# Altium schematic sheet KS-WL-GW-IO.SchDoc
size A3; CheckedBy: Fanmingjie; Author: Jason Huang; DrawnBy: Chen Minjie; Address1: Buliding 5, No.1528,; Address2: Gu Mei Rd HQ6,; Address3: Shanghai, China; Address4: 200233; Revision: 0.1; SheetNumber: 1; SheetTotal: 1; DocumentName: NGHA SCC V0.1; ProjectName: NGHA
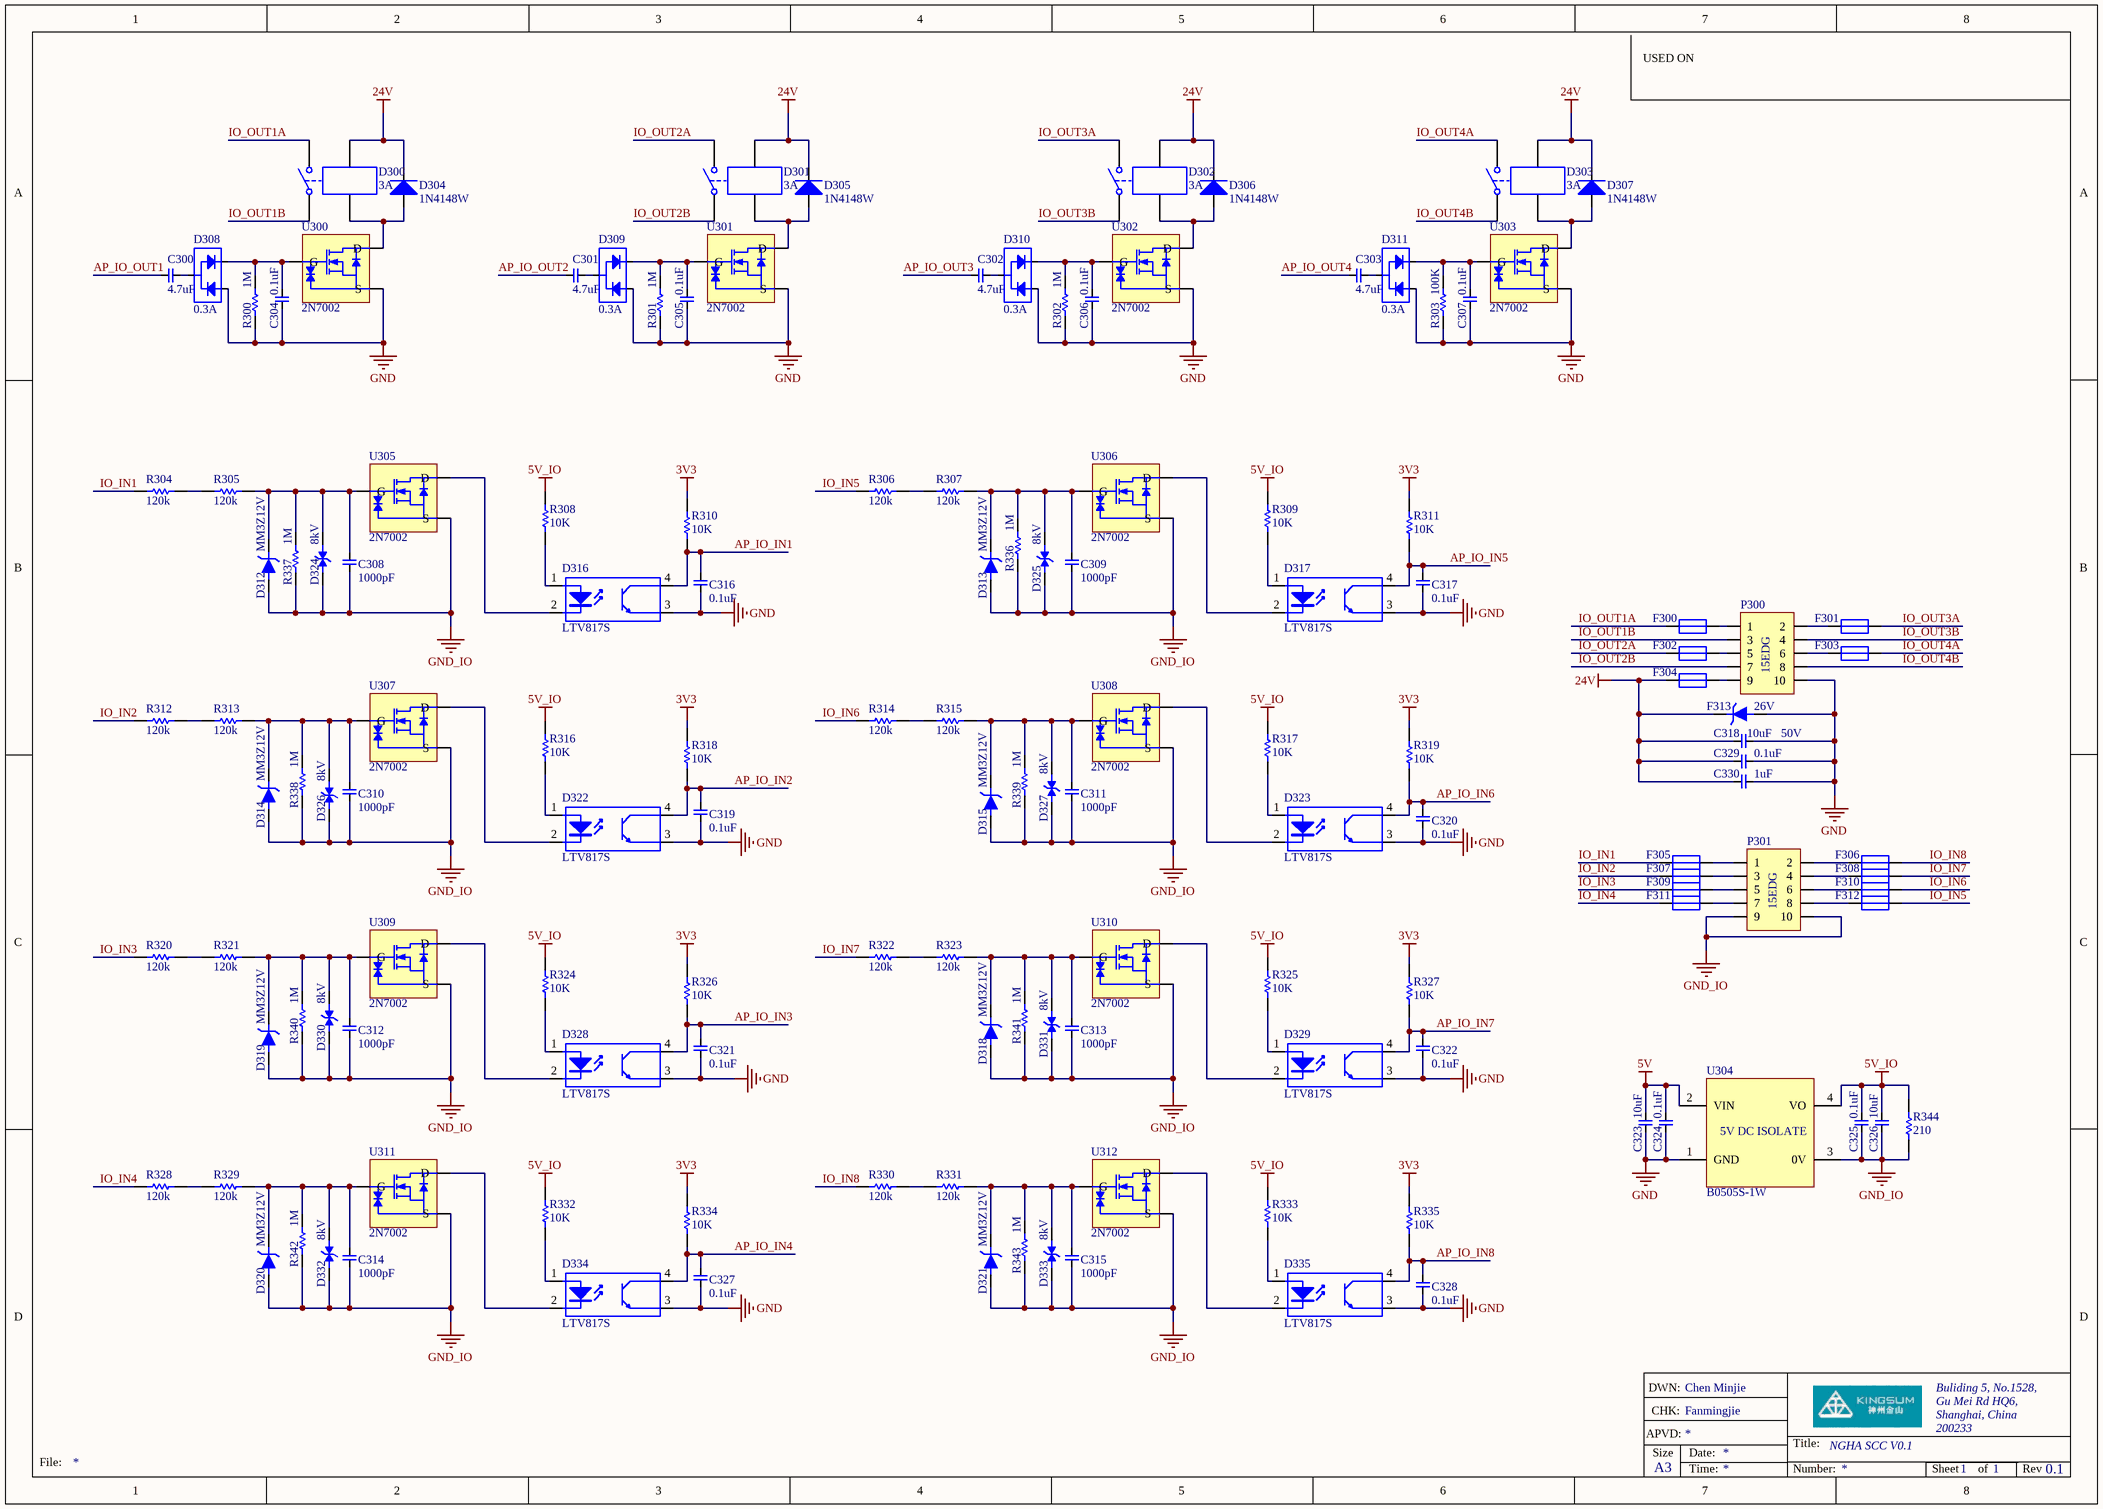
[diagram p0: KS-WL-GW-IO.SchDoc]

## Parts
C300  4.7uF  [C0805]
C301  4.7uF  [C0805]
C302  4.7uF  [C0805]
C303  4.7uF  [C0805]
C304  0.1uF  [0402 CAP]
C305  0.1uF  [0402 CAP]
C306  0.1uF  [0402 CAP]
C307  0.1uF  [0402 CAP]
C308  1000pF  [0402 CAP]
C309  1000pF  [0402 CAP]
C310  1000pF  [0402 CAP]
C311  1000pF  [0402 CAP]
C312  1000pF  [0402 CAP]
C313  1000pF  [0402 CAP]
C314  1000pF  [0402 CAP]
C315  1000pF  [0402 CAP]
C316  0.1uF  [0402 CAP]
C317  0.1uF  [0402 CAP]
C318  10uF  Volt-Rated: 50V  [C1206_L]
C319  0.1uF  [0402 CAP]
C320  0.1uF  [0402 CAP]
C321  0.1uF  [0402 CAP]
C322  0.1uF  [0402 CAP]
C323  10uF  [C1206_L]
C324  0.1uF  [0402 CAP]
C325  0.1uF  [0402 CAP]
C326  10uF  [C1206_L]
C327  0.1uF  [0402 CAP]
C328  0.1uF  [0402 CAP]
C329  0.1uF  [0402 CAP]
C330  1uF  [C0805]
D300  3A  [OJ]
D301  3A  [OJ]
D302  3A  [OJ]
D303  3A  [OJ]
D304  1N4148W  [SOD123]
D305  1N4148W  [SOD123]
D306  1N4148W  [SOD123]
D307  1N4148W  [SOD123]
D308  0.3A  [SOT-23-3]
D309  0.3A  [SOT-23-3]
D310  0.3A  [SOT-23-3]
D311  0.3A  [SOT-23-3]
D312  MM3Z12V  [LC-SOD-323]
D313  MM3Z12V  [LC-SOD-323]
D314  MM3Z12V  [LC-SOD-323]
D315  MM3Z12V  [LC-SOD-323]
D316  LTV817S  [TLV817S]
D317  LTV817S  [TLV817S]
D318  MM3Z12V  [LC-SOD-323]
D319  MM3Z12V  [LC-SOD-323]
D320  MM3Z12V  [LC-SOD-323]
D321  MM3Z12V  [LC-SOD-323]
D322  LTV817S  [TLV817S]
D323  LTV817S  [TLV817S]
D324  8kV  [0402 ESD]
D325  8kV  [0402 ESD]
D326  8kV  [0402 ESD]
D327  8kV  [0402 ESD]
D328  LTV817S  [TLV817S]
D329  LTV817S  [TLV817S]
D330  8kV  [0402 ESD]
D331  8kV  [0402 ESD]
D332  8kV  [0402 ESD]
D333  8kV  [0402 ESD]
D334  LTV817S  [TLV817S]
D335  LTV817S  [TLV817S]
F300  1206L025YR  [1206_FUSE]  (value not drawn)
F301  1206L025YR  [1206_FUSE]  (value not drawn)
F302  1206L025YR  [1206_FUSE]  (value not drawn)
F303  1206L025YR  [1206_FUSE]  (value not drawn)
F304  1206L025YR  [1206_FUSE]  (value not drawn)
F305  1206L025YR  [1206_FUSE]  (value not drawn)
F306  1206L025YR  [1206_FUSE]  (value not drawn)
F307  1206L025YR  [1206_FUSE]  (value not drawn)
F308  1206L025YR  [1206_FUSE]  (value not drawn)
F309  1206L025YR  [1206_FUSE]  (value not drawn)
F310  1206L025YR  [1206_FUSE]  (value not drawn)
F311  1206L025YR  [1206_FUSE]  (value not drawn)
F312  1206L025YR  [1206_FUSE]  (value not drawn)
F313  26V  [LC-SMB(DO-214AA)_S5]
P300  Kingsum-CONN-15EDG 5X2  [15EDG-5x2 LOCK]  (value not drawn)
P301  Kingsum-CONN-15EDG 5X2  [15EDG-5x2 LOCK]  (value not drawn)
R300  1M  [0402 Res]
R301  1M  [0402 Res]
R302  1M  [0402 Res]
R303  100K  [0402 Res]
R304  120k  [1206 RES]
R305  120k  [1206 RES]
R306  120k  [1206 RES]
R307  120k  [1206 RES]
R308  10K  [0402 Res]
R309  10K  [0402 Res]
R310  10K  [0402 Res]
R311  10K  [0402 Res]
R312  120k  [1206 RES]
R313  120k  [1206 RES]
R314  120k  [1206 RES]
R315  120k  [1206 RES]
R316  10K  [0402 Res]
R317  10K  [0402 Res]
R318  10K  [0402 Res]
R319  10K  [0402 Res]
R320  120k  [1206 RES]
R321  120k  [1206 RES]
R322  120k  [1206 RES]
R323  120k  [1206 RES]
R324  10K  [0402 Res]
R325  10K  [0402 Res]
R326  10K  [0402 Res]
R327  10K  [0402 Res]
R328  120k  [1206 RES]
R329  120k  [1206 RES]
R330  120k  [1206 RES]
R331  120k  [1206 RES]
R332  10K  [0402 Res]
R333  10K  [0402 Res]
R334  10K  [0402 Res]
R335  10K  [0402 Res]
R336  1M  [0402 Res]
R337  1M  [0402 Res]
R338  1M  [0402 Res]
R339  1M  [0402 Res]
R340  1M  [0402 Res]
R341  1M  [0402 Res]
R342  1M  [0402 Res]
R343  1M  [0402 Res]
R344  210  [0805 Res]
U300  2N7002  [SOT-23-3]
U301  2N7002  [SOT-23-3]
U302  2N7002  [SOT-23-3]
U303  2N7002  [SOT-23-3]
U304  B0505S-1W  [B0505S]
U305  2N7002  [SOT-23-3]
U306  2N7002  [SOT-23-3]
U307  2N7002  [SOT-23-3]
U308  2N7002  [SOT-23-3]
U309  2N7002  [SOT-23-3]
U310  2N7002  [SOT-23-3]
U311  2N7002  [SOT-23-3]
U312  2N7002  [SOT-23-3]

## Nets
3V3: R310.2 R311.2 R318.2 R319.2 R326.2 R327.2 R334.2 R335.2
5V: C323.2 C324.2 U304.2(VIN)
5V_IO: C325.2 C326.2 R308.2 R309.2 R316.2 R317.2 R324.2 R325.2 R332.2 R333.2 R344.2 U304.4(VO)
24V: C318.1 C329.2 C330.2 D300.4 D301.4 D302.4 D303.4 D304.2 D305.2 D306.2 D307.2 F304.1 F313.2
GND: C304.1 C305.1 C306.1 C307.1 C316.1 C317.1 C318.2 C319.1 C320.1 C321.1 C322.1 C323.1 C324.1 C327.1 C328.1 C329.1 C330.1 D308.1 D309.1 D310.1 D311.1 D316.3(A/K) D317.3(A/K) D322.3(A/K) D323.3(A/K) D328.3(A/K) D329.3(A/K) D334.3(A/K) D335.3(A/K) F313.1 P300.10 R300.2 R301.2 R302.2 R303.1 U300.2(S) U301.2(S) U302.2(S) U303.2(S) U304.1(GND)
GND_IO: C308.1 C309.1 C310.1 C311.1 C312.1 C313.1 C314.1 C315.1 C325.1 C326.1 D312.1 D313.1 D314.1 D315.1 D318.1 D319.1 D320.1 D321.1 D324.1 D325.1 D326.1 D327.1 D330.1 D331.1 D332.1 D333.1 P301.9 P301.10 R336.1 R337.1 R338.1 R339.1 R340.1 R341.1 R342.1 R343.1 R344.1 U304.3(0V) U305.2(S) U306.2(S) U307.2(S) U308.2(S) U309.2(S) U310.2(S) U311.2(S) U312.2(S)
AP_IO_IN1: C316.2 D316.4(A/K) R310.1
AP_IO_IN2: C319.2 D322.4(A/K) R318.1
AP_IO_IN3: C321.2 D328.4(A/K) R326.1
AP_IO_IN4: C327.2 D334.4(A/K) R334.1
AP_IO_IN5: C317.2 D317.4(A/K) R311.1
AP_IO_IN6: C320.2 D323.4(A/K) R319.1
AP_IO_IN7: C322.2 D329.4(A/K) R327.1
AP_IO_IN8: C328.2 D335.4(A/K) R335.1
AP_IO_OUT1: C300.2
AP_IO_OUT2: C301.2
AP_IO_OUT3: C302.2
AP_IO_OUT4: C303.2
IO_IN1: F305.1 R304.1
IO_IN2: F307.1 R312.1
IO_IN3: F309.1 R320.1
IO_IN4: F311.1 R328.1
IO_IN5: F312.2 R306.1
IO_IN6: F310.2 R314.1
IO_IN7: F308.2 R322.1
IO_IN8: F306.2 R330.1
IO_OUT1A: D300.2 F300.1
IO_OUT1B: D300.1 P300.3
IO_OUT2A: D301.2 F302.1
IO_OUT2B: D301.1 P300.7
IO_OUT3A: D302.2 F301.2
IO_OUT3B: D302.1 P300.4
IO_OUT4A: D303.2 F303.2
IO_OUT4B: D303.1 P300.8
NetC300_1: C300.1 D308.3
NetC301_1: C301.1 D309.3
NetC302_1: C302.1 D310.3
NetC303_1: C303.1 D311.3
NetC304_2: C304.2 D308.2 R300.1 U300.1(G)
NetC305_2: C305.2 D309.2 R301.1 U301.1(G)
NetC306_2: C306.2 D310.2 R302.1 U302.1(G)
NetC307_2: C307.2 D311.2 R303.2 U303.1(G)
NetC308_2: C308.2 D312.2 D324.2 R305.2 R337.2 U305.1(G)
NetC309_2: C309.2 D313.2 D325.2 R307.2 R336.2 U306.1(G)
NetC310_2: C310.2 D314.2 D326.2 R313.2 R338.2 U307.1(G)
NetC311_2: C311.2 D315.2 D327.2 R315.2 R339.2 U308.1(G)
NetC312_2: C312.2 D319.2 D330.2 R321.2 R340.2 U309.1(G)
NetC313_2: C313.2 D318.2 D331.2 R323.2 R341.2 U310.1(G)
NetC314_2: C314.2 D320.2 D332.2 R329.2 R342.2 U311.1(G)
NetC315_2: C315.2 D321.2 D333.2 R331.2 R343.2 U312.1(G)
NetD300_3: D300.3 D304.1 U300.3(D)
NetD301_3: D301.3 D305.1 U301.3(D)
NetD302_3: D302.3 D306.1 U302.3(D)
NetD303_3: D303.3 D307.1 U303.3(D)
NetD316_1: D316.1(A) R308.1
NetD316_2: D316.2(K) U305.3(D)
NetD317_1: D317.1(A) R309.1
NetD317_2: D317.2(K) U306.3(D)
NetD322_1: D322.1(A) R316.1
NetD322_2: D322.2(K) U307.3(D)
NetD323_1: D323.1(A) R317.1
NetD323_2: D323.2(K) U308.3(D)
NetD328_1: D328.1(A) R324.1
NetD328_2: D328.2(K) U309.3(D)
NetD329_1: D329.1(A) R325.1
NetD329_2: D329.2(K) U310.3(D)
NetD334_1: D334.1(A) R332.1
NetD334_2: D334.2(K) U311.3(D)
NetD335_1: D335.1(A) R333.1
NetD335_2: D335.2(K) U312.3(D)
NetF300_2: F300.2 P300.1
NetF301_1: F301.1 P300.2
NetF302_2: F302.2 P300.5
NetF303_1: F303.1 P300.6
NetF304_2: F304.2 P300.9
NetF305_2: F305.2 P301.1
NetF306_1: F306.1 P301.2
NetF307_2: F307.2 P301.3
NetF308_1: F308.1 P301.4
NetF309_2: F309.2 P301.5
NetF310_1: F310.1 P301.6
NetF311_2: F311.2 P301.7
NetF312_1: F312.1 P301.8
NetR304_2: R304.2 R305.1
NetR306_2: R306.2 R307.1
NetR312_2: R312.2 R313.1
NetR314_2: R314.2 R315.1
NetR320_2: R320.2 R321.1
NetR322_2: R322.2 R323.1
NetR328_2: R328.2 R329.1
NetR330_2: R330.2 R331.1

## Notes on the sheet
- USED ON
- DWN:
- APVD:
- CHK:
- Size
- Date:
- Title:
- File:
- A3
- Time:
- Number:
- Sheet
- of
- Rev
- (in symbol Kingsum-CONN-15EDG 5X2) 15EDG
- (in symbol Kingsum-DCDC-B0505S-1W) 5V DC ISOLATE

## Library data of the parts
C300-C303 = ADE-C0805-4.7U: Non-polarised capacitor; Part Rev: V; Part Description: CAPACITOR, CERAMIC CHIP, 0805 CASE, SURFACE MOUNT , 2.2 uF +/-10% 25 V, X5R; Mfr_PN: GRM219R61E475KA73; Manufacturer: MURATA; Tolerance: +/-10%; Volt-Rated: 25 V; Signal Integrity: Cap; Option: 0; TE PN: ADE-C0805-4.7U; Series: MLCC; RoHS Compliant: YES; Value: 4.7uF; Package: C0805; SPICE model: CAP; Published: 10/17/2016; Publisher: TE Connectivity; LatestRevisionDate: 04/22/2013; LatestRevisionNote: Production; ComponentLink1Description: Datasheet; ComponentLink1URL: http://engineeringportal.tycoelectronics.com/web/engineering/part-inquiry?PartNo=1-20065-7; ComponentLink3Description: Package; ComponentLink3URL: http://www.murata.com/products/catalog/pdf/c02e.pdf; ComponentLink2Description: Web Page; ComponentLink2URL: http://dmtec.tycoelectronics.com/dmtec/servlet/DocumentLookup?type=Production+Drawing&name=20065&format=PDF; Price: *; Stock: *; Stock Position: *
C304-C307 C329 = ADE-C0402-0.1U: Non-polarised capacitor; Part Rev: V; Part Description: CAPACITOR, CERAMIC CHIP, 0402 CASE, SURFACE MOUNT , 0.1 uF +/-20% 25 V, X7R; Mfr_PN: GRM155R61E104KA87; Manufacturer: MURATA; Tolerance: +/-10%; Volt-Rated: 25 V; Signal Integrity: Cap; Option: 0; TE PN: ADE-C0402-0.1U; Series: MLCC; RoHS Compliant: YES; Value: 0.1uF; Package: 0402; Footprint: 0402; SPICE model: CAP; Published: 10/14/2016; Publisher: TE Connectivity; LatestRevisionDate: 04/22/2013; LatestRevisionNote: Production; ComponentLink1Description: Datasheet; ComponentLink1URL: http://engineeringportal.tycoelectronics.com/web/engineering/part-inquiry?PartNo=1-20065-7; ComponentLink3Description: Package; ComponentLink3URL: http://www.murata.com/products/catalog/pdf/c02e.pdf; ComponentLink2Description: Web Page; ComponentLink2URL: http://dmtec.tycoelectronics.com/dmtec/servlet/DocumentLookup?type=Production+Drawing&name=20065&format=PDF; Manufacturer2: Yageo; Mfr_PN2: CC0402KRX7R8BB104
C308-C315 = ADE-C0402-1000P: Non-polarised capacitor; Part Rev: V; Part Description: CAPACITOR, CERAMIC CHIP, 0402 CASE, SURFACE MOUNT , 1000 pF +/-5% 50 V, C0G; Mfr_PN: GRM1555C1H102JA01; Manufacturer: MURATA; Tolerance: +/-5%; Volt-Rated: 50 V; Signal Integrity: Cap; Option: 0; TE PN: ADE-C0402-1000P; Series: MLCC; RoHS Compliant: YES; Value: 1000pF; Package: 0402; Footprint: 0402; SPICE model: CAP; Published: 10/17/2016; Publisher: TE Connectivity; LatestRevisionDate: 04/22/2013; LatestRevisionNote: Production; ComponentLink1Description: Datasheet; ComponentLink1URL: http://engineeringportal.tycoelectronics.com/web/engineering/part-inquiry?PartNo=1-20065-7; ComponentLink3Description: Package; ComponentLink3URL: http://www.murata.com/products/catalog/pdf/c02e.pdf; ComponentLink2Description: Web Page; ComponentLink2URL: http://dmtec.tycoelectronics.com/dmtec/servlet/DocumentLookup?type=Production+Drawing&name=20065&format=PDF; Price: *; Stock: *; Stock Position: *
C316 C317 C319-C322 C324 C325 C327 C328 = ADE-C0402-0.1U: Non-polarised capacitor; Part Rev: V; Part Description: CAPACITOR, CERAMIC CHIP, 0402 CASE, SURFACE MOUNT , 0.1 uF +/-20% 25 V, X7R; Manufacturer: MURATA; Tolerance: +/-10%; Volt-Rated: 25 V; Signal Integrity: Cap; Designator: GRM155R61E104KA87; Option: 0; TE PN: ADE-C0402-0.1U; Series: MLCC; RoHS Compliant: YES; Value: 0.1uF; Package: 0402; Footprint: 0402; SPICE model: CAP; Published: 10/14/2016; Publisher: TE Connectivity; LatestRevisionDate: 04/22/2013; LatestRevisionNote: Production; ComponentLink1Description: Datasheet; ComponentLink1URL: http://engineeringportal.tycoelectronics.com/web/engineering/part-inquiry?PartNo=1-20065-7; Mfr_PN: GRM155R61E104KA87; ComponentLink3Description: Package; ComponentLink3URL: http://www.murata.com/products/catalog/pdf/c02e.pdf; ComponentLink2Description: Web Page; ComponentLink2URL: http://dmtec.tycoelectronics.com/dmtec/servlet/DocumentLookup?type=Production+Drawing&name=20065&format=PDF; Manufacturer2: Yageo; Mfr_PN2: CC0402KRX7R8BB104
C318 = Kingsum-C1206-10U 50V: Non-polarised capacitor; Part Rev: V; Part Description: CAPACITOR, CERAMIC CHIP, 1206 CASE, SURFACE MOUNT , 10uF +/-20% 25V, X5R; Mfr_PN: GRM31CR61H106KA12L; Manufacturer: MURATA; Tolerance: +/-20%; Signal Integrity: Cap; Option: 0; Series: MLCC; RoHS Compliant: YES; Value: 10uF; Package: C1206_L; Footprint: C1206; SPICE model: CAP; Published: 10/17/2016; Publisher: TE Connectivity; LatestRevisionDate: 08/05/2013; LatestRevisionNote: Production; ComponentLink1Description: Procurement; ComponentLink1URL: http://www.szlcsc.com/product/details_78219.html; ComponentLink3Description: Package; ComponentLink2Description: Web Page; Price: 0.258; Kingsum PN: Kingsum-C1206-10U 50V
C323 C326 = ADE-C1206-10U: Non-polarised capacitor; Part Rev: V; Part Description: CAPACITOR, CERAMIC CHIP, 1206 CASE, SURFACE MOUNT , 10uF +/-20% 25V, X5R; Manufacturer: MURATA; Tolerance: +/-20%; Volt-Rated: 25V; Signal Integrity: Cap; Designator: GRM31CR61E106KE15; Option: 0; TE PN: ADE-C1206-10U; Series: MLCC; RoHS Compliant: YES; Value: 10uF; Package: C1206_L; Footprint: C1206; SPICE model: CAP; Published: 10/17/2016; Publisher: TE Connectivity; LatestRevisionDate: 08/05/2013; LatestRevisionNote: Production; ComponentLink1Description: Datasheet; ComponentLink1URL: http://www.murata.com/products/catalog/pdf/c02e.pdf; Mfr_PN: GRM31CR61E106KE15; ComponentLink3Description: Package; ComponentLink2Description: Web Page
C330 = ADE-C0805-1uF: Non-polarised capacitor; Part Rev: V; Part Description: CAPACITOR, CERAMIC CHIP, 0805 CASE, SURFACE MOUNT , 1uF +/-10% 50 V, X7R; Mfr_PN: CC0805K_X7R9BB106; Manufacturer: Yageo; Tolerance: +/-10%; Volt-Rated: 50V; Signal Integrity: Cap; Option: 0; TE PN: ADE-C0805-1uF; Series: MLCC; RoHS Compliant: YES; Value: 1uF; Package: C0805; SPICE model: CAP; Published: 10/17/2016; Publisher: TE Connectivity; LatestRevisionDate: 04/22/2013; LatestRevisionNote: Production; ComponentLink1Description: Datasheet; ComponentLink3Description: Package; ComponentLink3URL: http://www.yageo.com/documents/recent/UPY-GPHC_X7R_6.3V-to-50V_9.pdf; ComponentLink2Description: Web Page; Price: *; Stock: *; Stock Position: *
D300-D303 = ADE-RELAY-OJE-SS-112LM: Relay OJE 3A, VAC277, VDC 30V, Coil 12V, 320R, 450mW; Part Rev: A; Manufacturer: TE; Volt-Rated: 277 V AC; Option: 0; TE_PN: ADE-RELAY-OJE-SS-112LM; ComponentLink2Description: Web Page; ComponentLink2URL: http://www.te.com/catalog/pn/en/4-1419128-6?RQPN=OJE-SS-112LM%2C000; Series: RELAY; Part Description: Relay OJE 3A, VAC277, VDC 30V, Coil 12V, 320R, 450mW; Mfr_PN: OJE-SS-112LM; ComponentLink3URL: javascript:optReg_ShowPopUp('optRegProductDocs','http://www.te.com/commerce/DocumentDelivery/DDEController?Action=showdoc&DocId=Customer+Drawing%7F1461103%7FD2%7Fpdf%7FEnglish%7FENG_CD_1461103_D2.pdf%7F4-1419128-3',false,'false',true,'null');; RoHS Compliant: YES; Value: 3A; Package: OJE-SS-112LM; Footprint: OJE-SS-112LM; Published: 21/05/2013; Publisher: TE Connectivity; LatestRevisionDate: 01/10/2010; LatestRevisionNote: Production; ComponentLink1URL: javascript:optReg_ShowPopUp('optRegProductDocs','http://www.te.com/commerce/DocumentDelivery/DDEController?Action=showdoc&DocId=Specification+Or+Standard%7F108-79767%7FA2%7Fpdf%7FJapanese%7FJPN_SS_108-79767_A2.pdf%7F4-1419128-3',false,'false',true,'null');; ComponentLink1Description: Datasheet; ComponentLink3Description: Package
D304-D307 = ADE-DIODE-1N4148W: DIODE, Signal, 75V 150mA SOD-123; Part Rev: A; Manufacturer: DIODES; Value: 300mA; Power-Rated: 200mW; Option: 0; TE_PN: ADE-DIODE-1N4148W; ComponentLink2Description: Web Page; ComponentLink2URL: http://www.taiwansemi.com/home/en/products/product_info.php?partid=SS14; Series: Diode; Part Description: DIODE, Signal, 75V 150mA SOD-123; Mfr_PN: 1N4148W; ComponentLink3URL: http://www.taiwansemi.com/home/en/products/product_info.php?partid=SS14; RoHS Compliant: YES; Package: SOD123; Volt-Rated: 75V; SPICE model: Diode; Published: 11/02/2014; Publisher: TE Connectivity; LatestRevisionDate: 27/02/2013; LatestRevisionNote: Production; ComponentLink1URL: http://www.taiwansemi.com/home/en/products/product_info.php?partid=SS14; ComponentLink1Description: Datasheet; ComponentLink3Description: Package
D308-D311 = Kingsum-DIODES-BAT54S: SOT-23-3, 30V,200mA, Serial A K; Mfr_PN: BAT54S; Manufacturer: JCST; Power-Rated: 255mW; Option: 0; Tmp Range: -5 to 155; Kingsum_PN: Kingsum-DIODES-BAT54S; Part Rev: A; Series: Diode; Part Description: SOT-23-3, 30V,200mA, Serial A K; ComponentLink3URL: http://www.szlcsc.com/product/details_9087.html; RoHS Compliant: YES; Value: 0.3A; Package: SOT-23-3; Volt-Rated: 30 V; SPICE model: Diode; Published: 24/02/2014; LatestRevisionDate: 27/02/2013; LatestRevisionNote: Production; ComponentLink3Description: Procurement; Price: 0.09
D312-D315 D318-D321 = Kingsum-ZEN-MM3Z12V: Zener, 12V, 300 mW, SOD-323; Part Rev: A; Manufacturer: EIC; Volt-Rated: 32V; Signal Integrity: Res; Option: 0; Tmp Range: -40 to 85; Kingsum_PN: Kingsum-ZEN-MM3Z12V; ComponentLink2Description: Web Page; Series: FUSE; Part Description: Zener, 12V, 300 mW, SOD-323; Mfr_PN: MM3Z12V; ComponentLink3URL: http://www.szlcsc.com/product/details_62903.html; RoHS Compliant: YES; Value: 12V; Package: SOD-323; Footprint: SOD-323; SPICE model: RESISTOR; Published: 07/05/2013; Publisher: TE Connectivity; LatestRevisionDate: 11/15/2012; LatestRevisionNote: Production; ComponentLink1Description: Datasheet; ComponentLink3Description: Procurement; Manufacturer2: 先科ST; Price: 0.06
D316 D317 D322 D323 D328 D329 D334 D335 = ADE-PHOTOCOUPLER-LTV817S: Photo coupler,Vceo80V,Ic50mA,ISO3750Vrms; Part Rev: A; Part Description: Photo coupler,Vceo30V,Ic50mA,ISO5000Vrms; Manufacturer: LiteON; Value: 50mA; Volt-Rated: 35V; Option: 0; TE_PN: ADE-PHOTOCOUPLER-LTV817S; ComponentLink2Description: Web Page; Series: PHOTOTRAIC; Mfr_PN: LTV817S; RoHS Compliant: YES; Package: 4pin MFSOP6; Footprint: MFSOP6; Published: 21/05/2013; Publisher: TE Connectivity; LatestRevisionDate: 01/10/2010; LatestRevisionNote: Production; ComponentLink1Description: Datasheet; ComponentLink3Description: Package
D324-D327 D330-D333 = Kingsum-ESD-LXES15AAA1: 8kV, 0.05pF, <0.1ns; Part Rev: A; Manufacturer: Murata; Volt-Rated: 24V; Signal Integrity: Res; Option: 0; Tmp Range: -40 to 85; Kingsum_PN: Kingsum-ESD-LXES15AAA1; ComponentLink2Description: Web Page; Series: FUSE; Part Description: 8kV, 0.05pF, <0.1ns; Mfr_PN: LXES15AAA1; ComponentLink3URL: http://www.szlcsc.com/product/details_87317.html; RoHS Compliant: YES; Value: 8kV; Package: SMB; Footprint: SMB; SPICE model: RESISTOR; Designator: LXES15AAA1; Published: 07/05/2013; Publisher: TE Connectivity; LatestRevisionDate: 11/15/2012; LatestRevisionNote: Production; ComponentLink1Description: Datasheet; ComponentLink3Description: Procurement; Price: 0.0
F300-F312 = Kingsum-FUSE-1206L025YR: 1206 Fuse 0.25A ,16V; Part Rev: A; Manufacturer: Littelfuse; Value: 0.25; Signal Integrity: Res; Option: 0; Tmp Range: -40 to 85; Kingsum_PN: Kingsum-FUSE-1206L025YR; ComponentLink2Description: Web Page; Series: FUSE; Part Description: 1206 Fuse 0.25A; Mfr_PN: 1206L025YR; ComponentLink3URL: http://www.szlcsc.com/product/details_100777.html; RoHS Compliant: YES; Package: 1206 FUSE; Volt-Rated: 16V; Footprint: 1206 FUSE; SPICE model: RESISTOR; Published: 07/05/2013; Publisher: TE Connectivity; LatestRevisionDate: 11/15/2012; LatestRevisionNote: Production; ComponentLink1Description: Datasheet; ComponentLink3Description: Procurement
F313 = Kingsum-TVS-SMBJ26A: SMB, 26V, 600W; Part Rev: A; Manufacturer: Littelfuse; Signal Integrity: Res; Option: 0; Tmp Range: -40 to 85; Kingsum_PN: Kingsum-TVS-SMBJ26A; ComponentLink2Description: Web Page; Series: FUSE; Part Description: SMB, 26V, 600W; Mfr_PN: SMBJ26A; ComponentLink3URL: http://www.szlcsc.com/product/details_125093.html; RoHS Compliant: YES; Value: 600W; Package: SMB; Volt-Rated: 26V; Footprint: SMB; SPICE model: RESISTOR; Published: 07/05/2013; Publisher: TE Connectivity; LatestRevisionDate: 11/15/2012; LatestRevisionNote: Production; ComponentLink1Description: Datasheet; ComponentLink3Description: Procurement; Price: 0.0
P300 P301 = Kingsum-CONN-15EDG 5X2: Header, 10pin, 5x2; Manufacturer: 奥斯电子有限公司; Mfr_PN: 15EDGKDM-3.81-5P Set; Part Description: Header 15EDG Right angle 3.81mm 2X5P; Option: 0; LatestRevisionDate: 17-Jul-2002; LatestRevisionNote: Re-released for DXP Platform.; Publisher: Belle 13600268167; ComponentLink2Description: Web Page; ComponentLink1Description: Datasheet; ComponentLink3Description: Package; Price: 9.72; Footprint: HDR2X12
R300-R302 R336-R343 = ADE-R0402-1M: RESISTOR  Normal; Part Rev: A; Part Description: RESISTOR, CHIP, THICK FILM, SURGE CURRENT, 0402 CASE, 1/16 W, 50 V , 20K OHMS +/-5%, +/-100 PPM/DEG C, TIN TERMINATION; Mfr_PN: RC0402JR-7D1ML; Manufacturer: YAGEO; Precision: +/-5%; Volt-Rated: 50 V; Power-Rated: 1/16 W; Signal Integrity: Res; Option: 0; TE_PN: ADE-R0402-1M; ComponentLink2Description: Web Page; ComponentLink2URL: http://dmtec.tycoelectronics.com/dmtec/servlet/DocumentLookup?type=Production+Drawing&name=1900457&format=PDF; Series: General Purpose Chip Resistors; ComponentLink3URL: http://www.yageo.com/documents/recent/PYu-RC0402_51_RoHS_L_6_r.pdf; RoHS Compliant: YES; Value: 1M; Package: 0402; Footprint: kOA1E-0402; SPICE model: RESISTOR; Published: 25/04/2013; Publisher: TE Connectivity; LatestRevisionDate: 25/04/2013; LatestRevisionNote: Production; ComponentLink1URL: http://engineeringportal.tycoelectronics.com/web/engineering/part-inquiry?PartNo=1900457-1; ComponentLink1Description: Datasheet; ComponentLink3Description: Package
  R336-R343: Designator: RC0402JR-7D1ML
R303 = ADE-R0402-100K: RESISTOR  Normal; Part Rev: A; Part Description: RESISTOR, CHIP, THICK FILM, SURGE CURRENT, 0402 CASE, 1/16 W, 50 V , 100K OHMS +/-5%, +/-100 PPM/DEG C, TIN TERMINATION; Mfr_PN: RC0402JR-7D100KL; Manufacturer: YAGEO; Precision: +/-5%; Volt-Rated: 50 V; Power-Rated: 1/16 W; Signal Integrity: Res; Option: 0; TE_PN: ADE-R0402-100K; ComponentLink2Description: Web Page; ComponentLink2URL: http://dmtec.tycoelectronics.com/dmtec/servlet/DocumentLookup?type=Production+Drawing&name=1900457&format=PDF; Series: General Purpose Chip Resistors; ComponentLink3URL: http://www.yageo.com/documents/recent/PYu-RC0402_51_RoHS_L_6_r.pdf; RoHS Compliant: YES; Value: 100K; Package: 0402; Footprint: kOA1E-0402; SPICE model: RESISTOR; Published: 27/03/2014; Publisher: TE Connectivity; LatestRevisionDate: 25/04/2013; LatestRevisionNote: Production; ComponentLink1URL: http://engineeringportal.tycoelectronics.com/web/engineering/part-inquiry?PartNo=1900457-1; ComponentLink1Description: Datasheet; ComponentLink3Description: Package
R304-R307 R312-R315 R320-R323 R328-R331 = ADE-R1206-120k: RES, TF-SMT1206, 120k Ohm, 1% 1/4W; Part Rev: A; Mfr_PN: RC1206JR-07120KL; Manufacturer: Yageo; Precision: +/-5%; Volt-Rated: 200V; Power-Rated: 0.25W; TE_PN: ADE-R1206-120k; ComponentLink2Description: Web Page; Series: General Purpose Chip Resistors; Part Description: RES, TF-SMT1206, 120k Ohm, 1% 1/4W; RoHS Compliant: YES; Value: 120k; Package: 1206; Footprint: 1206; SPICE model: RESISTOR; Signal Integrity: Res; Published: 24/02/2014; Publisher: TE Connectivity; LatestRevisionDate: 9/2010; LatestRevisionNote: Production; ComponentLink1URL: http://www.yageo.com/documents/recent/PYu-RC1206_51_RoHS_L_4.pdf; ComponentLink1Description: Datasheet; ComponentLink3Description: Package
R308-R311 R316-R319 R324-R327 R332-R335 = ADE-R0402-10K: RESISTOR  Normal; Part Rev: A; Part Description: RESISTOR, CHIP, THICK FILM, SURGE CURRENT, 0402 CASE, 1/16 W, 50 V , 10K OHMS +/-5%, +/-100 PPM/DEG C, TIN TERMINATION; Mfr_PN: RC0402JR-7D10KL; Manufacturer: YAGEO; Precision: +/-5%; Volt-Rated: 50 V; Power-Rated: 1/16 W; Signal Integrity: Res; Option: 0; TE_PN: ADE-R0402-10K; ComponentLink2Description: Web Page; ComponentLink2URL: http://dmtec.tycoelectronics.com/dmtec/servlet/DocumentLookup?type=Production+Drawing&name=1900457&format=PDF; Series: General Purpose Chip Resistors; ComponentLink3URL: http://www.yageo.com/documents/recent/PYu-RC0402_51_RoHS_L_6_r.pdf; RoHS Compliant: YES; Value: 10K; Package: 0402; Footprint: kOA1E-0402; SPICE model: RESISTOR; Published: 25/04/2013; Publisher: TE Connectivity; LatestRevisionDate: 25/04/2013; LatestRevisionNote: Production; ComponentLink1URL: http://engineeringportal.tycoelectronics.com/web/engineering/part-inquiry?PartNo=1900457-1; ComponentLink1Description: Datasheet; ComponentLink3Description: Package
R344 = ADE-R0805-210R: RESISTOR  Normal; Part Rev: A; Part Description: RESISTOR, CHIP, THICK FILM, SURGE CURRENT, 0805 CASE, 1/8 W, 150V, 1 A , 210 OHMS +/-5%, +/-200 PPM/DEG C, TIN TERMINATION; Mfr_PN: RC0805JR-7D210RL; Manufacturer: YAGEO; Precision: +/-5%; Volt-Rated: 150 V; Power-Rated: 1/8 W; Signal Integrity: Res; Option: 0; TE_PN: ADE-R0805-210R; ComponentLink2Description: Web Page; ComponentLink2URL: http://dmtec.tycoelectronics.com/dmtec/servlet/DocumentLookup?type=Production+Drawing&name=1900457&format=PDF; Series: General Purpose Chip Resistors; ComponentLink3URL: http://www.yageo.com/documents/recent/PYu-RC0402_51_RoHS_L_6_r.pdf; RoHS Compliant: YES; Value: 210; Package: 0805; Footprint: kOA2A-0805; SPICE model: RESISTOR; Designator: RC0805JR-7D210RL; Published: 25/04/2013; Publisher: TE Connectivity; LatestRevisionDate: 11/15/2012; LatestRevisionNote: Production; ComponentLink1Description: Datasheet; ComponentLink3Description: Package
U300-U303 = Kingsum-NMOS-2N7002: +60V 115mA, NMOS, 7OHm at 5V; Manufacturer: TI; Kingsum PN: Kingsum-OPA-OPA2340UA; Option: 0; Tmp Range: -65 to 150; Publisher: FMJ; ComponentLink1Description: Datasheet; ComponentLink1URL: Datasheet/TDIODES; ComponentLink2Description: Web Page; ComponentLink3Description: Procurement; ComponentLink3URL: http://www.szlcsc.com/product/details_66260.html; Code_IPC: *; Code_JEITA: *; Footprint: SOT23; LatestRevisionNote: PRODUCTION; Mfr_PN: 2N7002; Package: SOT23; Part Rev: *; Published: 2N7002; RoHS Compliant: YES; Part Description: +60V 115mA, NMOS, 7OHm at 5V; Price: 10; Stock: *; Stock Position: *
U304 = Kingsum-DCDC-B0505S-1W: DC/DC module 5Vin 5Vout, 1W, 1000V; Manufacturer: MORNSUN; Option: 0; Publisher: FMJ; ComponentLink1Description: Datasheet; ComponentLink1URL: Datasheet/DCDC; ComponentLink2Description: Web Page; ComponentLink3Description: Procurement; ComponentLink3URL: https://item.taobao.com/item.htm?spm=a1z10.3-c.w4002-15231643157.18.6e5dfb10cHAq7M&id=14277528359; Code_IPC: *; Code_JEITA: *; LatestRevisionNote: PRODUCTION; Mfr_PN: B0505S-1W; Package: B0505S; Part Rev: *; Published: 10/14/2016; RoHS Compliant: YES; Kingsum PN: Kingsum-DCDC-B0505S-1W; Part Description: DC/DC module 5Vin 5Vout, 1W, 1000V; Price: 8.38; Stock: *; Stock Position: *
U305-U312 = Kingsum-NMOS-2N7002: +60V 115mA, NMOS, 7OHm at 5V; Manufacturer: TI; Option: 0; Kingsum PN: Kingsum-OPA-OPA2340UA; Tmp Range: -65 to 150; Published: 2N7002; Publisher: FMJ; Code_IPC: *; ComponentLink1Description: Datasheet; ComponentLink1URL: Datasheet/TDIODES; ComponentLink2Description: Web Page; ComponentLink3Description: Procurement; ComponentLink3URL: http://www.szlcsc.com/product/details_66260.html; Footprint: SOT23; Mfr_PN: 2N7002; Package: SOT23; Part Description: +60V 115mA, NMOS, 7OHm at 5V; Part Rev: *; RoHS Compliant: YES; LatestRevisionNote: PRODUCTION; Price: 10; Stock: *; Stock Position: *; Code_JEITA: *